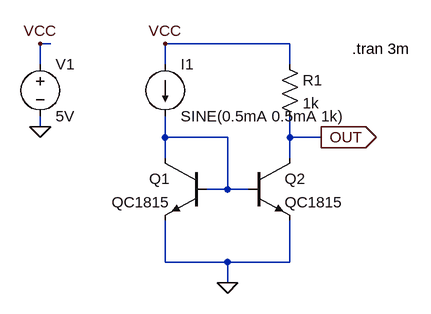
[diagram p0: schematic CurrentMirror1_sine.asc]
CurrentMirror1_sine.asc, the LTspice schematic file:
Version 4
SHEET 1 880 680
WIRE -432 -128 -448 -128
WIRE -64 -128 -256 -128
WIRE -448 -96 -448 -128
WIRE -256 -96 -256 -128
WIRE -64 -96 -64 -128
WIRE -448 0 -448 -16
WIRE -256 16 -256 -16
WIRE -160 16 -256 16
WIRE -64 16 -64 -16
WIRE -16 16 -64 16
WIRE -256 48 -256 16
WIRE -64 48 -64 16
WIRE -160 96 -160 16
WIRE -160 96 -192 96
WIRE -128 96 -160 96
WIRE -256 208 -256 144
WIRE -160 208 -256 208
WIRE -64 208 -64 144
WIRE -64 208 -160 208
WIRE -160 240 -160 208
FLAG -160 240 0
FLAG -256 -128 VCC
FLAG -448 0 0
FLAG -448 -128 VCC
FLAG -16 16 OUT
IOPIN -16 16 Out
SYMBOL npn -192 48 M0
SYMATTR InstName Q1
SYMATTR Value QC1815
SYMBOL npn -128 48 R0
SYMATTR InstName Q2
SYMATTR Value QC1815
SYMBOL current -256 -96 R0
WINDOW 123 0 0 Left 2
WINDOW 39 0 0 Left 2
SYMATTR InstName I1
SYMATTR Value SINE(0.5mA 0.5mA 1k)
SYMBOL res -80 -112 R0
SYMATTR InstName R1
SYMATTR Value 1k
SYMBOL voltage -448 -112 R0
WINDOW 123 0 0 Left 2
WINDOW 39 0 0 Left 2
SYMATTR InstName V1
SYMATTR Value 5V
TEXT 32 -120 Left 2 !.tran 3m

The netlist it stands for:
* CurrentMirror1_sine.asc
Q1 N001 N001 0 0 QC1815
Q2 OUT N001 0 0 QC1815
I1 VCC N001 SINE(0.5mA 0.5mA 1k)
R1 VCC OUT 1k
V1 VCC 0 5V
.model NPN NPN
.model PNP PNP
.lib standard.bjt
.tran 3m
.backanno
.end